# EasyEDA Pro project project-rp2350-board.epro, board PCB1
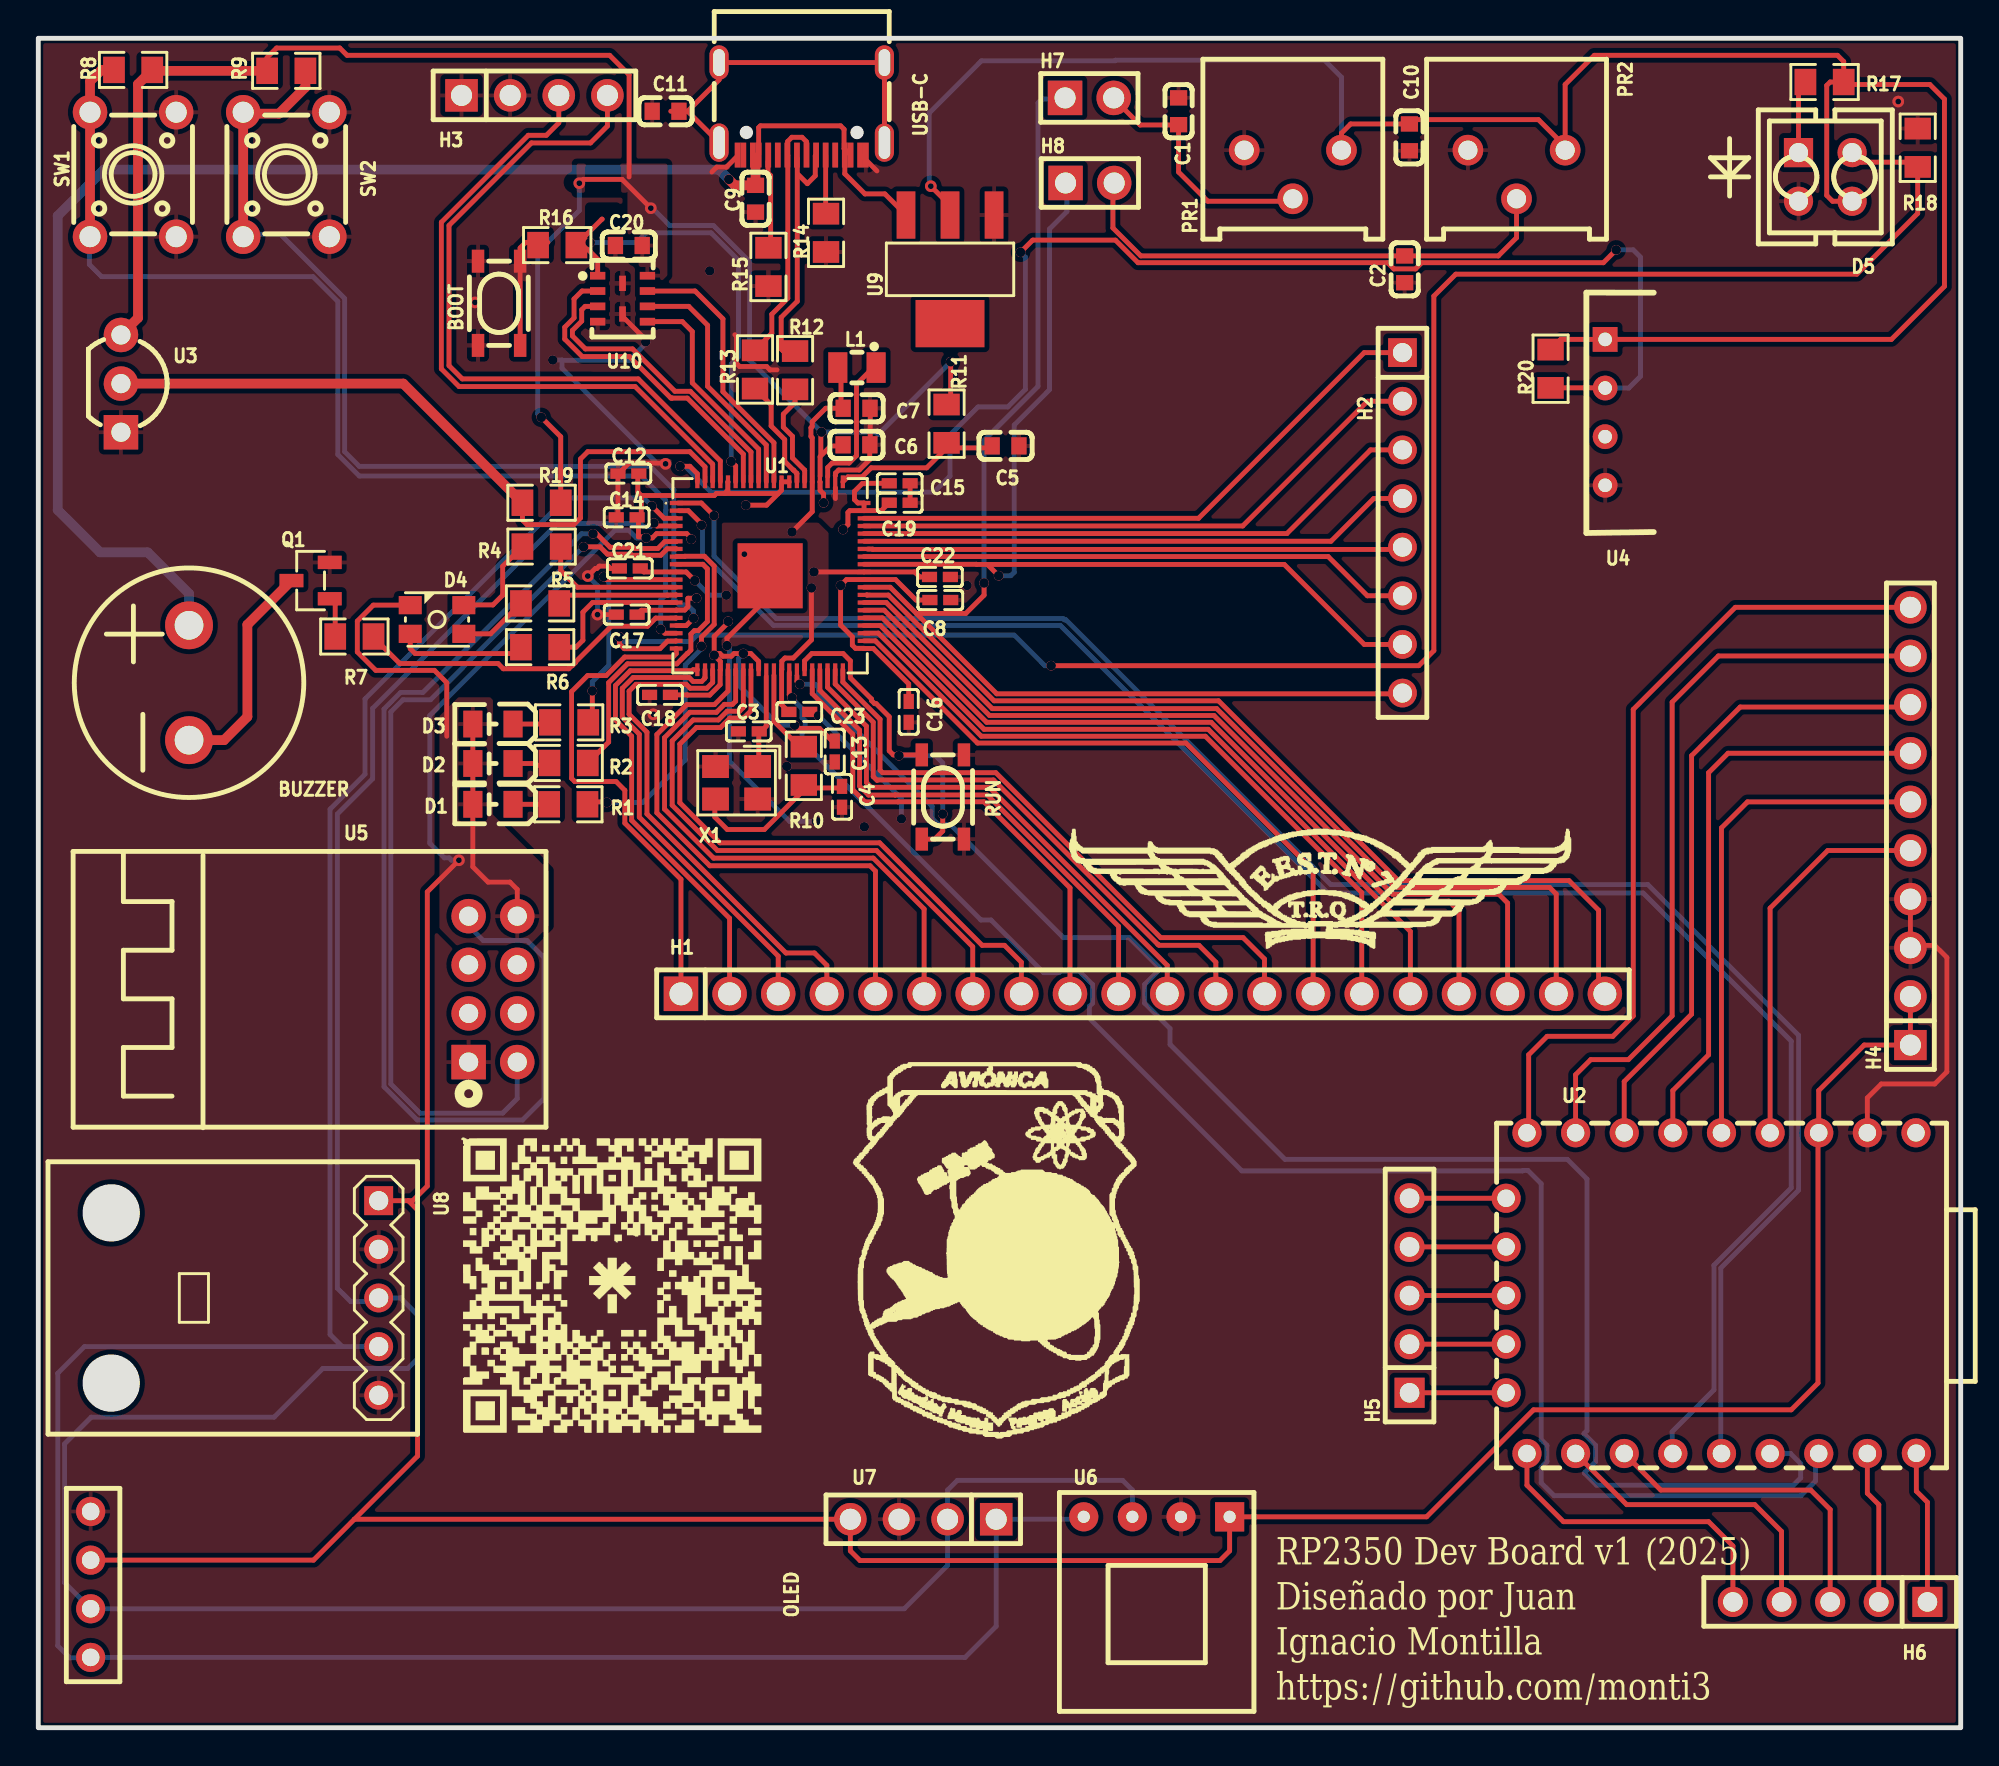
[diagram p1: board, top side]
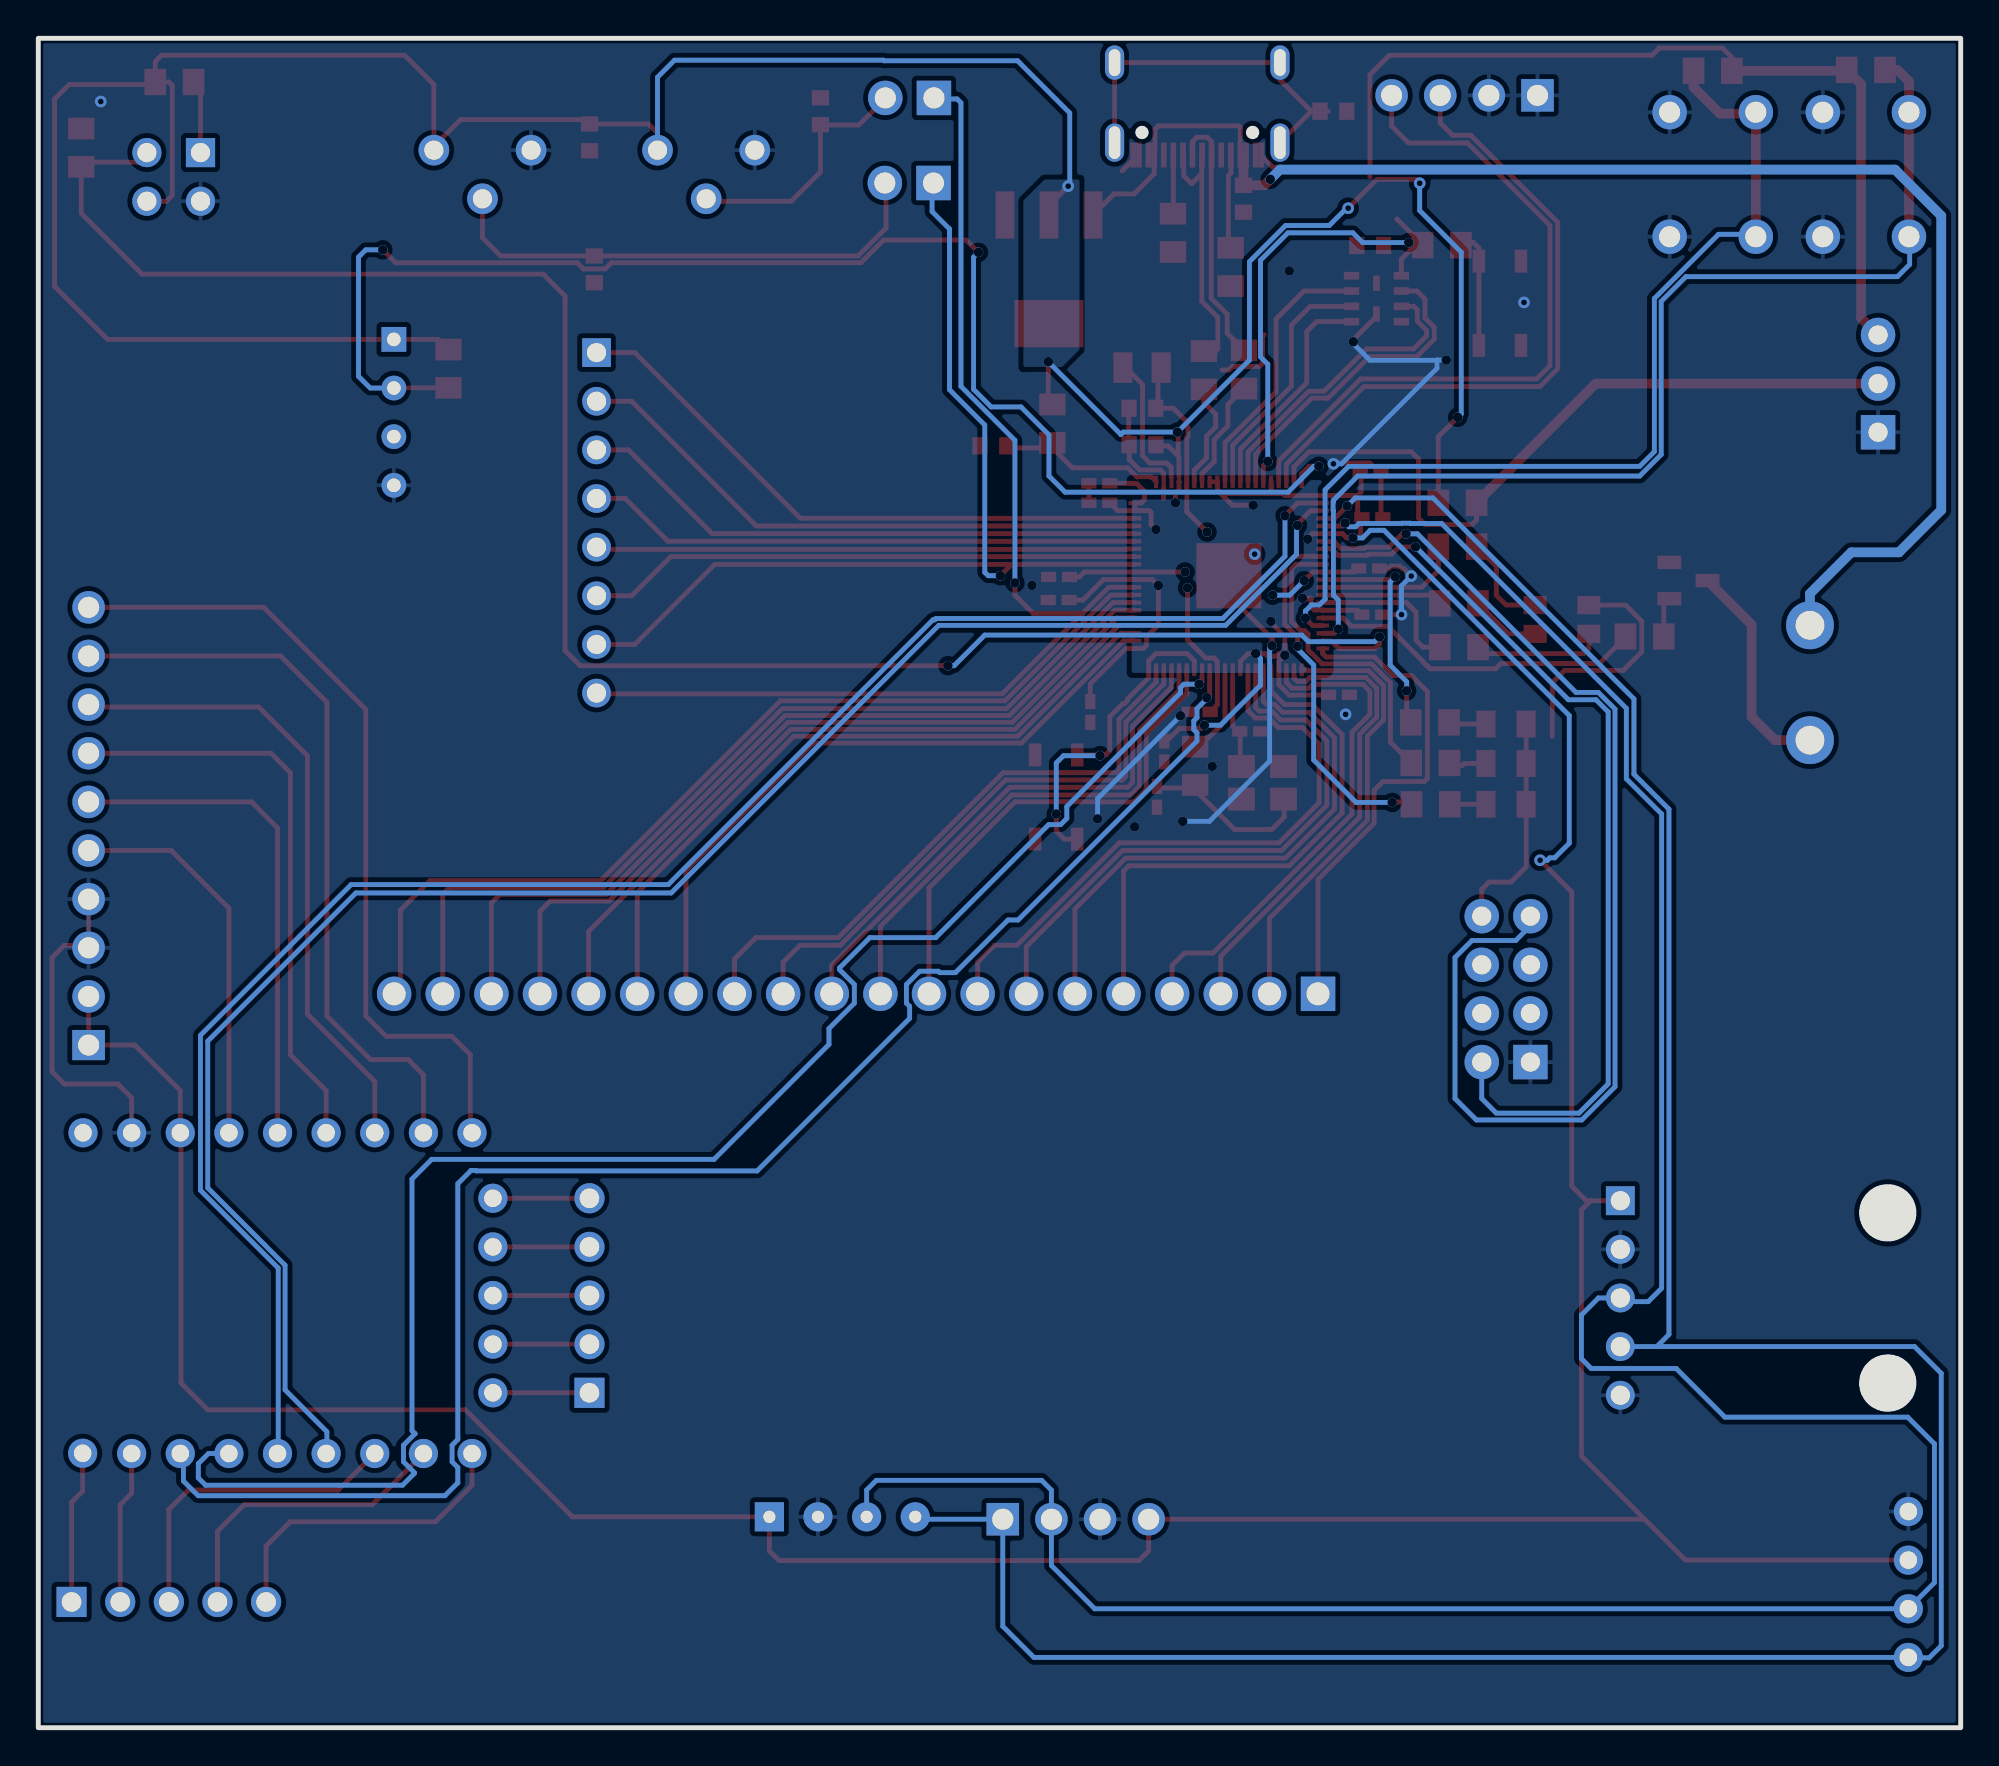
[diagram p2: board, bottom side, seen from below]

Outline 100.42 x 88.23 mm; copper layers: Top Layer, Bottom Layer. Coordinates in mm from the lower left corner of the outline.
Outline path: rectangle 0,88.23 100.42,0
Stack: Top Layer 0.035mm / Dielectric1 1.51mm FR4 er 4.5 / Bottom Layer 0.035mm

## Design rules (mm)
net $1N10864: DP1
net USB_D-: DP2
net $1N10892: DP1
net USB_D+: DP2
template: JLCPCB Capability(Two Layers Board)
spacing copperThickness1oz (default): track to track 0.102, other pairs 0.152 to 0.3
spacing copperThickness2oz: track to track 0.203, other pairs 0.152 to 0.3
track width copperThickness1oz (default): min 0.127, default 0.254, max 2.54
track width copperThickness2oz: min 0.203, default 0.254, max 2.54
differential pair differentialPair (default): width min 0.127, default 0.254, max 2.54; gap min 0.152, default 0.152
via viaSize (default): diameter min 0.5, default 0.61, max 10; hole min 0.3, default 0.305, max 6.3

## Placement (name value [footprint] x y rotation side)
BOOT  K2-1808SN-A4SW-01  [KEY-SMD_4P-L4.2-W3.2-P2.20-LS5.1-TL]  24.07 74.39 270 top
BUZZER  buzzer  [BUZ-TH_BD12.0-P6.00-D0.9-RD]  7.87 54.57 90 top
C1  100nF  [C0603]  59.56 84.42 90 top
C2  100nF  [C0603]  71.37 76.16 270 top
C3  15pF  [C0402]  37.11 52.03 0 top
C4  15pF  [C0402]  41.98 48.62 270 top
C5  4.7uF  [C0603]  50.53 66.94 0 top
C6  4.7uF  [C0603]  42.74 67 0 top
C7  4.7uF  [C0603]  42.74 68.91 180 top
C8  100nF  [C0402]  47.12 58.89 180 top
C9  100nF  [C0603]  37.47 79.85 90 top
C10  100nF  [C0603]  71.62 83.06 90 top
C11  1nF  [C0603]  32.77 84.42 180 top
C12  100nF  [C0402]  30.82 65.5 0 top
C13  100nF  [C0402]  41.6 50.98 90 top
C14  100nF  [C0402]  30.73 63.21 0 top
C15  100nF  [C0402]  45 64.99 180 top
C16  100nF  [C0402]  45.47 53.05 90 top
C17  100nF  [C0402]  30.73 58.13 0 top
C18  100nF  [C0402]  32.47 53.94 0 top
C19  100nF  [C0402]  45 63.97 180 top
C20  100nF  [C0603]  30.85 77.41 0 top
C21  100nF  [C0402]  30.9 60.54 0 top
C22  100nF  [C0402]  47.1 60.1 180 top
C23  4.7uF  [C0402]  39.75 53.05 180 top
D1  YLED0805W  [LED0805-R-RD_WHITE]  23.75 48.22 180 top
D2  YLED0805W  [LED0805-R-RD_WHITE]  23.75 50.36 180 top
D3  YLED0805W  [LED0805-R-RD_WHITE]  23.75 52.42 180 top
D4  CLV1H-FKB-CMPRTHKBB2367453  [LED-SMD_4P-L3.2-W2.8-LS3.5-TL-B]  20.83 57.88 0 top
D5  CNY70  [OPTO-TH_CNY70]  93.34 80.99 0 top
H1  -  [HDR-TH_20P-P2.54-V-M-1]  57.7 38.33 0 top
H2  -  [HDR-TH_8P-P2.54-V-M]  71.26 62.92 270 top
H3  -  [HDR-TH_4P-P2.54-V-F]  25.92 85.25 0 top
H4  PZ254V-11-10P  [HDR-TH_10P-P2.54-V-M-1]  97.79 47.08 90 top
H5  -  [HDR-TH_5P-P2.54-V-F]  71.63 22.57 90 top
H6  -  [HDR-TH_5P-P2.54-V-F]  93.6 6.57 180 top
H7  -  [HDR-TH_2P-P2.54-V-M-1]  54.9 85.12 0 top
H8  -  [HDR-TH_2P-P2.54-V-M-1]  54.93 80.67 0 top
L1  AOTA-B201610S3R3-101-T  [IND-SMD_L2.0-W1.6_AOTA-B201610S3R3-101-T]  42.76 71.03 0 top
OLED  SSD1306 I2C OLED  [OLED_0.91_128X32]  0.2 13.83 0 top
PR1  10K  [RES-ADJ-TH_3P-L9.5-W9.5-P2.54-BR-BS]  65.53 81.12 90 top
PR2  10K  [RES-ADJ-TH_3P-L9.5-W9.5-P2.54-BR-BS]  77.22 81.12 90 top
Q1  S8050  [SOT-23-3_L2.9-W1.3-P1.90-LS2.4-BR]  14.22 59.91 0 top
R1  33kΩ  [R0805]  27.69 48.22 180 top
R2  33kΩ  [R0805]  27.7 50.38 180 top
R3  33kΩ  [R0805]  27.73 52.5 180 top
R4  33kΩ  [R0805]  26.29 61.69 180 top
R5  33kΩ  [R0805]  26.21 58.72 180 top
R6  33kΩ  [R0805]  26.21 56.43 180 top
R7  33kΩ  [R0805]  16.51 56.99 180 top
R8  33kΩ  [R0805]  4.95 86.58 180 top
R9  33kΩ  [R0805]  12.95 86.53 0 top
R10  1K  [R0805]  39.99 50.23 270 top
R11  33  [R0805]  47.44 68.1 270 top
R12  22R  [R0805]  39.53 70.9 90 top
R13  22R  [R0805]  37.44 70.93 90 top
R14  5K1  [R0805]  41.15 78.07 90 top
R15  5K1  [R0805]  38.14 76.29 90 top
R16  1kΩ  [R0805]  27.11 77.43 0 top
R17  100R  [R0805]  93.31 85.95 180 top
R18  10K  [R0805]  98.17 82.51 90 top
R19  10K  [R0805]  26.29 63.97 0 top
R20  10K  [R0805]  78.99 70.97 90 top
RUN  K2-1808SN-A4SW-01  [KEY-SMD_4P-L4.2-W3.2-P2.20-LS5.1-TL]  47.25 48.61 90 top
SW1  B3F-1000  [KEY-TH_4P-L6.2-W6.2-P4.50-LS6.5]  4.95 81.12 90 top
SW2  B3F-1000  [KEY-TH_4P-L6.2-W6.2-P4.50-LS6.5]  12.95 81.12 90 top
U1  RP2350B  [QFN-80_L10.0-W10.0-P0.40-TL-EP3.4]  38.23 60.16 0 top
U2  RP2040-Zero  [COMM-SMD_RP2040-ZERO]  87.38 22.57 270 top
U3  DS18B20  [TO-92-3_L4.8-W3.7-P2.54-R]  4.32 70.2 270 top
U4  DHT11  [SENSOR-TH_DHT11_90DEG]  81.84 68.69 270 top
U5  2.4GHz  [WIFIM-TH_8P-L24.7-W14.4-P2.54]  23.75 38.57 180 top
U6  BMP180  [BMP-180]  58.42 5.93 0 top
U7  HTU21D  [HDR-TH_4P-P2.54-V-M]  46.23 10.89 180 top
U8  -  [GY-302 (BH1750)]  10.16 22.44 180 top
U9  -  [SOT-223-4_L6.5-W3.5-P2.30-LS7.0-BR]  47.62 76.16 90 top
U10  W25Q32JVUUIQ  [USON-8_L4.0-W3.0-P0.80-BL_WINBOND_UU]  30.52 74.63 270 top
USB-C  -  [USB-C-SMD_KH-TYPE-C-16P]  39.88 84.55 180 top
X1  ABM8-272-T3  [CRYSTAL-SMD_4P-L3.2-W2.5-BL]  36.47 49.35 180 top

## Footprints (pads in the part's own frame, mm; a bottom-side part is the same pattern mirrored in y, then rotated)
BMP-180
  rect 1.524x1.524 hole 0.635: 1(3.81,5.08)
  round 1.524 hole 0.635: 2(1.27,5.08) 3(-1.27,5.08) 4(-3.81,5.08)
BUZ-TH_BD12.0-P6.00-D0.9-RD
  round 2.5 hole 1.5: 1(-3,0) 2(3,0)
C0402
  rect 0.79x0.54 smd: 1(-0.545,0) 2(0.545,0)
C0603
  rect 0.8x0.9 smd: 1(-0.7,0) 2(0.7,0)
COMM-SMD_RP2040-ZERO
  round 1.524 hole 0.914: 1(8.238,10.725) 2(8.25,8.165) 3(8.25,5.625) 4(8.25,3.085) 5(8.25,0.545) 6(8.25,-1.995) 7(8.25,-4.535) 8(8.25,-7.075) 9(8.25,-9.615) 10(5.08,-10.705) 11(2.54,-10.705) 12(0,-10.705) 13(-2.54,-10.705) 14(-5.08,-10.705) 15(-8.5,-9.615) 16(-8.5,-7.075) 17(-8.5,-4.535) 18(-8.5,-1.995) 19(-8.5,0.545) 20(-8.5,3.085) 21(-8.5,5.625) 22(-8.5,8.165) 23(-8.5,10.705)
CRYSTAL-SMD_4P-L3.2-W2.5-BL
  rect 1.4x1.2 smd: 1(-1.1,-0.85) 2(1.1,-0.85) 3(1.1,0.85) 4(-1.1,0.85)
GY-302 (BH1750)
  rect 1.508x1.508 hole 1x1: 1(-7.62,-5.08)
  round 1.508 hole 1x1: 2(-7.62,-2.54) 3(-7.62,0) 4(-7.62,2.54) 5(-7.62,5.08)
HDR-TH_2P-P2.54-V-M-1
  rect 1.8x1.8 hole 1.1: 1(-1.27,0)
  round 1.8 hole 1.1: 2(1.27,0)
HDR-TH_4P-P2.54-V-F
  rect 1.7x1.7 hole 1.1: 1(-3.81,0)
  round 1.7 hole 1.1: 2(-1.27,0) 3(1.27,0) 4(3.81,0)
HDR-TH_4P-P2.54-V-M
  rect 1.7x1.7 hole 1.1: 1(-3.81,0)
  round 1.7 hole 1.1: 2(-1.27,0) 3(1.27,0) 4(3.81,0)
HDR-TH_5P-P2.54-V-F
  rect 1.575x1.575 hole 1.02: 1(-5.08,0)
  round 1.575 hole 1.02: 2(-2.54,0) 3(0,0) 4(2.54,0) 5(5.08,0)
HDR-TH_8P-P2.54-V-M
  rect 1.5x1.5 hole 1: 1(-8.89,0)
  round 1.5 hole 1: 2(-6.35,0) 3(-3.81,0) 4(-1.27,0) 5(1.27,0) 6(3.81,0) 7(6.35,0) 8(8.89,0)
HDR-TH_10P-P2.54-V-M-1
  rect 1.575x1.7 hole 1.1: 1(-11.43,0)
  round 1.7 hole 1.1: 2(-8.89,0) 3(-6.35,0) 4(-3.81,0) 5(-1.27,0) 6(1.27,0) 7(3.81,0) 8(6.35,0) 9(8.89,0) 10(11.43,0)
HDR-TH_20P-P2.54-V-M-1
  rect 1.8x1.8 hole 1.2: 1(-24.13,0)
  round 1.8 hole 1.2: 2(-21.59,0) 3(-19.05,0) 4(-16.51,0) 5(-13.97,0) 6(-11.43,0) 7(-8.89,0) 8(-6.35,0) 9(-3.81,0) 10(-1.27,0) 11(1.27,0) 12(3.81,0) 13(6.35,0) 14(8.89,0) 15(11.43,0) 16(13.97,0) 17(16.51,0) 18(19.05,0) 19(21.59,0) 20(24.13,0)
IND-SMD_L2.0-W1.6_AOTA-B201610S3R3-101-T
  rect 1x1.6 smd: 1(-1,0) 2(1,0)
KEY-SMD_4P-L4.2-W3.2-P2.20-LS5.1-TL
  rect 1.2x0.65 smd: 1(-2.2,1.1) 2(2.2,1.1) 3(-2.2,-1.1) 4(2.2,-1.1)
KEY-TH_4P-L6.2-W6.2-P4.50-LS6.5
  round 1.8 hole 1.1: 1(-3.251,2.251) 2(3.251,2.251) 3(-3.251,-2.251) 4(3.251,-2.251)
LED0805-R-RD_WHITE
  rect 1x1.399 smd: 1(1.05,0) 2(-1.05,0)
LED-SMD_4P-L3.2-W2.8-LS3.5-TL-B
  rect 1.2x0.95 smd: 1(-1.4,0.75) 2(-1.4,-0.75) 3(1.4,-0.75) 4(1.4,0.75)
OLED_0.91_128X32
  round 1.524 hole 0.914: 1(2.54,-2.54) 2(2.54,-5.08) 3(2.54,-7.62) 4(2.54,-10.16)
OPTO-TH_CNY70
  rect 1.524x1.524 hole 1: 1(-1.4,1.27)
  round 1.524 hole 1: 2(-1.4,-1.27) 3(1.4,-1.27) 4(1.4,1.27)
QFN-80_L10.0-W10.0-P0.40-TL-EP3.4
  rect 0.665x0.22 smd: 1(-4.907,3.8) 2(-4.907,3.4) 3(-4.907,3) 4(-4.907,2.6) 5(-4.907,2.2) 6(-4.907,1.8) 7(-4.907,1.4) 8(-4.907,1) 9(-4.907,0.6) 10(-4.907,0.2) 11(-4.907,-0.2) 12(-4.907,-0.6) 13(-4.907,-1) 14(-4.907,-1.4) 15(-4.907,-1.8) 16(-4.907,-2.2) 17(-4.907,-2.6) 18(-4.907,-3) 19(-4.907,-3.4) 20(-4.907,-3.8) 41(4.907,-3.8) 42(4.907,-3.4) 43(4.907,-3) 44(4.907,-2.6) 45(4.907,-2.2) 46(4.907,-1.8) 47(4.907,-1.4) 48(4.907,-1) 49(4.907,-0.6) 50(4.907,-0.2) 51(4.907,0.2) 52(4.907,0.6) 53(4.907,1) 54(4.907,1.4) 55(4.907,1.8) 56(4.907,2.2) 57(4.907,2.6) 58(4.907,3) 59(4.907,3.4) 60(4.907,3.8)
  rect 0.22x0.665 smd: 21(-3.8,-4.907) 22(-3.4,-4.907) 23(-3,-4.907) 24(-2.6,-4.907) 25(-2.2,-4.907) 26(-1.8,-4.907) 27(-1.4,-4.907) 28(-1,-4.907) 29(-0.6,-4.907) 30(-0.2,-4.907) 31(0.2,-4.907) 32(0.6,-4.907) 33(1,-4.907) 34(1.4,-4.907) 35(1.8,-4.907) 36(2.2,-4.907) 37(2.6,-4.907) 38(3,-4.907) 39(3.4,-4.907) 40(3.8,-4.907) 61(3.8,4.907) 62(3.4,4.907) 63(3,4.907) 64(2.6,4.907) 65(2.2,4.907) 66(1.8,4.907) 67(1.4,4.907) 68(1,4.907) 69(0.6,4.907) 70(0.2,4.907) 71(-0.2,4.907) 72(-0.6,4.907) 73(-1,4.907) 74(-1.4,4.907) 75(-1.8,4.907) 76(-2.2,4.907) 77(-2.6,4.907) 78(-3,4.907) 79(-3.4,4.907) 80(-3.8,4.907)
  rect 3.4x3.4 smd: 81(0,0)
R0805
  rect 1.133x1.377 smd: 1(-1,0) 2(1,0)
RES-ADJ-TH_3P-L9.5-W9.5-P2.54-BR-BS
  round 1.6 hole 1: 1(1.27,-2.54) 2(-1.27,0) 3(1.27,2.54)
SENSOR-TH_DHT11_90DEG
  rect 1.296x1.296 hole 0.711: 1(-3.81,0)
  round 1.296 hole 0.711: 2(-1.27,0) 3(1.27,0) 4(3.81,0)
SOT-23-3_L2.9-W1.3-P1.90-LS2.4-BR
  rect 1.25x0.7 smd: 1(1,-0.95) 2(1,0.95) 3(-1,0)
SOT-223-4_L6.5-W3.5-P2.30-LS7.0-BR
  rect 2.47x0.98 smd: 1(2.835,-2.3) 2(2.835,0) 3(2.835,2.3)
  rect 2.47x3.6 smd: 4(-2.835,0)
TO-92-3_L4.8-W3.7-P2.54-R
  rect 1.8x1.8 hole 1: 1(2.54,0)
  round 1.8 hole 1: 2(0,0) 3(-2.54,0)
USB-C-SMD_KH-TYPE-C-16P
  oval 1x2 hole 0.6x1.7: 1(-4.32,1.765) 2(4.32,1.765)
  oval 1x1.8 hole 0.6x1.4: 3(-4.32,-2.415) 4(4.32,-2.415)
  rect 0.3x1.3 smd: A1(-3.35,2.415) A4(-2.55,2.415) A5(-1.25,2.415) A6(-0.25,2.415) A7(0.25,2.415) A8(1.25,2.415) A9(2.55,2.415) A12(3.35,2.415) B1(3.05,2.415) B4(2.25,2.415) B5(1.75,2.415) B6(0.75,2.415) B7(-0.75,2.415) B8(-1.75,2.415) B9(-2.25,2.415) B12(-3.05,2.415)
USON-8_L4.0-W3.0-P0.80-BL_WINBOND_UU
  rect 0.4x0.8 smd: 1(-1.2,-1.3) 2(-0.4,-1.3) 3(0.4,-1.3) 4(1.2,-1.3) 5(1.2,1.3) 6(0.4,1.3) 7(-0.4,1.3) 8(-1.2,1.3)
  rect 0.8x0.35 smd: 9(-0.802,0) 10(0.798,0)
WIFIM-TH_8P-L24.7-W14.4-P2.54
  rect 1.8x1.8 hole 1: 1(1.27,3.81)
  round 1.8 hole 1: 2(1.27,1.27) 3(1.27,-1.27) 4(1.27,-3.81) 5(-1.27,3.81) 6(-1.27,1.27) 7(-1.27,-1.27) 8(-1.27,-3.81)

## Nets
As in the schematic, except:
1V1: C7.2 C21.2 C22.2 C23.2 L1.1 U1.10 U1.32 U1.51 U1.65
3V3: C6.1 C8.2 C10.2 C12.2 C13.2 C14.2 C15.2 C16.2 C17.2 C18.2 C19.2 C20.2 D1.1 D2.1 D3.1 D4.1 D5.3 H4.1 H4.2 OLED.2 PR1.1 PR2.1 R8.1 R9.1 R11.1 R17.1 R19.2 R20.2 U1.5 U1.15 U1.24 U1.29 U1.41 U1.50 U1.59 U1.60 U1.64 U1.68 U1.69 U1.76 U2.21 U3.3 U4.1 U5.8 U6.1 U7.4 U8.1 U9.2 U10.8
5V: BUZZER.2 C9.2 U9.3 USB-C.A4 USB-C.A9 USB-C.B4 USB-C.B9
RP2040_ADC0: H4.8 U2.17
RP2040_ADC1: H4.7 U2.18
RP2040_ADC2: H4.6 U2.19
RP2040_ADC3: H4.5 U2.20
RP2040_GP14: H4.10 U2.15
RP2040_GP15: H4.9 U2.16
RP2350_GP18: R8.2 SW1.1 SW1.2 U1.18
$1N24500: BUZZER.1 Q1.3

Pads without a net: U2 23; U4 3; U5 2 3 6 7; U9 4; USB-C A8 B8

## Via types
v1: diameter 0.5, hole 0.5, Top Layer to Bottom Layer, 55 vias
v2: diameter 0.61, hole 0.305, Top Layer to Bottom Layer, 11 vias

## Routing (per net, layer and track width the routed paths; a pad name or vN(x,y) marks a point on that pad's centre or on a via; arc(x,y) is an arc through that point)
1V1: length 28.6
  Top Layer w0.254: 39.21,53.05 38.83,53.43 U1.32 38.84,55.26 38.84,55.7 39,55.86 39.44,55.86 40.39,56.81 v1(40.39,59.53) ; v1(40.51,60.36) U1.51 45.78,60.36 46.04,60.1 46.4,60.1 ; v1(39.37,62.45) 40.43,63.51 U1.65 40.43,67.37 40.36,67.43 40.36,67.89 40.43,67.96 40.43,68.2 41.13,68.91 C7.2 ; v1(34.29,59.91) 33.84,60.36 U1.10 31.63,60.36 C21.2 ; 41.93,69.02 41.93,70.88
  Bottom Layer w0.254: v1(34.29,59.91) 35.05,59.15 v1(35.94,59.15)
3V3: length 477.8
  Top Layer w0.254: 36.07,57.75 35.31,56.99 v1(35.31,56.01) ; v2(46.62,80.51) 47.57,79.56 47.57,79.51 ; 19.33,27.52 U8.1 ; 19.33,27.52 19.56,27.52 20.32,28.29 20.32,43.65 v2(21.97,45.3) ; 19.33,27.52 19.81,27.04 19.81,14.19 16.51,10.89 ; U1.76 36.02,65.06 36.02,64.62 35.85,64.46 ; v1(26.28,68.43) 27.29,67.42 R19.2 ; v2(28.26,80.66) 28.46,80.86 30.49,80.86 v2(32,79.36) ; v1(35.31,56.01) 35.63,55.69 U1.24 35.62,55.24 35.62,54.47 35.07,53.93 33.91,53.93 33.9,53.94 33.02,53.94 ; v1(35.31,56.01) 35.39,56.1 35.6,56.1 35.74,55.96 36.2,55.96 36.34,56.1 v1(36.83,56.1) 37.22,56.1 37.63,55.69 U1.29 ; 71.81,83.86 71.93,83.98 78.36,83.98 79.76,82.59 ; U5.8 25.02,43.78 24.64,44.16 23.5,44.16 22.7,44.96 D1.1 D2.1 D3.1 ; R20.2 79.53,72.5 U4.1 96.8,72.5 99.57,75.28 99.57,85.05 98.81,85.82 94.44,85.82 R17.1 94.31,87.01 93.98,87.34 81.28,87.34 79.76,85.82 79.76,82.59 ; 31.5,64.35 35.31,64.35 35.42,64.46 35.85,64.46 ; 31.5,64.35 31.5,63.35 31.35,63.2 31.35,62.19 31.69,62.19 v1(31.75,62.14) 32.07,62.14 32.3,62.36 U1.5 33.87,62.36 34.16,62.07 ; 31.5,64.35 31.32,64.53 31.32,65.44 C12.2 ; 38.65,64.46 38.82,64.62 38.82,65.06 U1.69 U1.68 ; 38.65,64.46 35.85,64.46 ; 38.65,64.46 38.04,63.85 v1(36.96,63.85) ; 16.51,10.89 14.38,8.75 2.74,8.75 ; 16.51,10.89 U7.4 42.42,9.24 42.93,8.73 61.72,8.73 62.23,9.24 U6.1 72.52,11.01 78.1,16.6 91.57,16.6 92.96,18 92.96,31.03 U2.21 93,33.28 95.38,35.65 97.79,35.65 H4.2 ; 40.84,65.38 40.84,66.38 41.4,66.94 42.09,66.94 ; v1(41.02,63.97) 41.02,64.44 40.84,64.62 40.84,65.06 U1.64 ; C13.2 41.47,51.53 40.81,52.19 39.67,52.19 v1(39.51,52.36) ; 94.06,85.95 93.6,85.95 93.42,85.77 93.42,80.03 93.73,79.72 D5.3 ; 79.76,82.59 79.76,82.39 ; U1.59 42.39,63.56 42.29,63.46 42.29,62.83 v1(42.04,62.58) ; U1.59 44.04,63.56 44.45,63.97 ; U1.59 U1.60 42.81,63.96 42.63,64.14 42.63,64.57 43.03,64.97 43.18,64.97 43.2,64.99 44.45,64.99 ; 30.86,80.99 30.86,86.32 29.84,87.34 16.13,87.34 15.75,87.72 12.45,87.72 11.94,87.21 ; 68.07,82.39 68.07,83.28 68.55,83.76 C10.2 ; C16.2 45.47,54.51 43.62,56.36 U1.41 43.12,56.37 42.69,56.37 42.52,56.53 42.52,56.97 41.91,57.58 v1(41.91,59.65) 42.22,59.96 U1.50 44.78,59.96 45.85,58.89 46.29,58.89 46.42,58.77 ; 47.66,69.24 v1(47.66,71.34) ; C17.2 31.51,58.36 U1.15 33.33,58.37 33.77,58.37 33.93,58.53 33.93,58.97 33.95,58.99 v1(34.38,58.99) ; v1(40.91,67.66) 40.88,67.63 40.88,66.48 ; 21.34,51.78 21.34,54.57 20.69,55.22 17.63,55.22 16.66,56.18 16.66,57.79 17.5,58.63 D4.1
  Top Layer w0.508: U3.3 5.21,73.62 5.21,85.83 R8.1 6,86.53 R9.1
  Bottom Layer w0.254: v1(36.83,56.1) 36.58,55.84 36.58,54.45 38.67,52.36 v1(39.51,52.36) ; v1(26.28,68.43) 26.27,68.43 26.09,68.61 26.09,77.06 28.26,79.23 v2(28.26,80.66) ; v2(21.97,45.3) 21.59,45.3 21.46,45.43 21.21,45.43 20.45,46.19 20.45,52.86 30.12,62.53 30.85,62.53 31.24,62.14 v1(31.75,62.14) ; 32.17,79.26 32.98,78.45 35.26,78.45 37.15,76.56 37.15,71.42 v1(40.91,67.66) 43.74,67.66 43.87,67.54 47.63,71.3 ; 68.07,82.39 68.07,86.2 67.18,87.09 56.27,87.09 56.24,87.06 49.26,87.06 46.54,84.33 46.54,80.48
  vias: v1(34.11,62.07) v1(36.04,57.78)
5V: length 77.5
  Top Layer w0.254: U9.3 44.22,80.1 43.18,80.1 42.13,81.15 42.13,82.13 ; 37.63,82.13 37.63,83.57 37.72,83.66 41.91,83.66 42.09,83.48 42.09,82.47 42.43,82.13
  Top Layer w0.508: v1(36.07,80.86) 36.38,80.55 C9.2 37.47,81.99
  Bottom Layer w0.508: BUZZER.2 7.87,59.23 5.72,61.38 3.22,61.38 1.02,63.59 1.02,78.96 3.43,81.37 35.56,81.37 v1(36.07,80.86)
GND: length 78.9
  Top Layer w0.254: 43.81,81.3 43.08,82.03 43.08,82.04 ; U1.81 38.23,59.15 35.97,56.89 v1(35.97,56.51) ; 31.77,72.45 30.54,73.68 30.54,73.73 ; U2.22 95.54,32.89 96.27,33.62 99.06,33.62 99.69,34.25 99.69,40.22 99.06,40.86 97.92,40.86 H4.3 97.79,43.27 ; C21.1 29.88,60.54 29.76,60.67 29.3,60.67 29.18,60.54 29.1,60.54 v2(28.7,60.15) ; 43.43,66.91 43.43,66.23 42.89,65.68 41.8,65.68 41.64,65.52 41.64,65.4 41.63,65.4 ; 36.53,82.13 36.53,82.09 35.94,81.5 35.43,81.5 35.18,81.24 ; 36.38,72.75 36.47,72.66 36.47,71.25 36.63,71.09 38.04,71.09 38.22,70.91 38.59,70.91 ; 43.46,68.96 43.46,67.24 43.34,67.12 ; C17.1 v2(29.21,58.13) ; C14.1 30.28,63.3 C12.1 30.31,65.5 30.86,66.05 32.55,66.05 32.64,66.13 ; C19.1 C15.1 ; 41.64,64.19 41.64,64.74 41.63,64.75
  Bottom Layer w0.254: v2(28.7,60.15) 29.21,59.64 v2(29.21,58.13) ; 31.76,72.31 30.86,71.41 27.36,71.41 ; 27.36,71.41 27.34,71.43 v1(26.87,71.43) ; 27.36,71.41 27.36,70.99 32.35,66 v2(32.77,66) ; 26.87,71.41 26.83,71.41 ; v1(40.64,47.34) 39.24,47.34 36.1,50.48 36.1,56.38 v1(35.97,56.51) ; v1(45.09,47.46) 45.09,48.52 v1(40.76,52.85)
  vias: v1(31.73,72.38) v1(35.07,76.08) v1(39.1,50.21) v1(43.15,47.05) v1(48.51,59.65) v2(22.81,74.44) v2(32.13,52.92) v2(36.88,61.29) v2(97.16,84.93)
I2C_SCL_0: length 94.6
  Top Layer w0.254: v1(34.65,62.8) 34.65,62.87 33.95,63.56 33.47,63.56
  Bottom Layer w0.254: U2.6 85.34,14.36 85.34,15.46 87.53,17.64 87.53,24.15 91.57,28.19 91.57,35.85 83.83,43.59 67.36,43.59 53.38,57.57 38.4,57.57 34.7,61.27 34.7,62.75 v1(34.65,62.8)
I2C_SCL_1: length 148.9
  Top Layer w0.254: v1(32.16,62.91) 32.31,62.76 U1.4
  Bottom Layer w0.254: v1(32.16,62.91) 31.96,62.72 31.6,62.72 ; 31.6,62.72 31.44,62.89 29.22,62.89 29.21,62.9 28.75,62.9 28.73,62.89 27.12,62.89 17.47,53.24 17.47,49.56 15.62,47.72 15.62,22.95 16.32,22.25 17.59,22.25 U8.3 18.92,22.44 19.81,21.55 19.81,19.27 19.3,18.76 14.86,18.76 12.32,16.22 2.77,16.22 1.37,14.82 1.37,7.58 OLED.3 45.24,6.21 47.5,8.47 47.5,12.41 48.01,12.92 56.64,12.92 57.15,12.41 U6.3
I2C_SDA_0: length 94.8
  Top Layer w0.254: 33.42,63.96 34.64,63.96 v1(35.3,63.3)
  Bottom Layer w0.254: v1(35.3,63.3) 35.3,61.18 38.55,57.93 53.53,57.93 53.6,57.86 53.69,57.86 67.51,44.03 84.07,44.03 91.95,36.16 91.95,28.07 87.88,24.01 87.88,14.36 U2.5
I2C_SDA_1: length 147.6
  Top Layer w0.254: v1(32.05,63.8) 32.69,63.16 U1.3
  Bottom Layer w0.254: U6.4 54.48,10.89 U7.1 50.04,5.3 48.41,3.67 OLED.4 2.71,3.65 1.65,3.65 1.02,4.28 1.02,18.51 2.41,19.9 15.88,19.9 ; 15.88,19.9 U8.4 ; 15.88,19.9 15.24,20.54 15.24,47.97 17.07,49.8 17.07,53.73 27.57,64.23 31.62,64.23 v1(32.05,63.8)
QSPI_SCLK: length 13
  Top Layer w0.254: 38.03,65.07 38.03,66.99 34.96,70.05 34.96,73.24 33.98,74.23 U10.6
QSPI_SD0: length 11.8
  Top Layer w0.254: U10.5 33.64,73.43 34.16,72.91 34.16,70.24 37.63,66.77 37.63,65.07
QSPI_SD1: length 17
  Top Layer w0.254: U1.74 36.83,66.52 33.91,69.44 33.11,69.44 33.11,69.44 33.04,69.44 30.88,71.61 28.41,71.61 27.5,72.52 27.5,73.14 27.99,73.63 27.99,74.62 28.4,75.03 U10.2
QSPI_SD2: length 15.9
  Top Layer w0.254: U10.3 28.56,74.23 28.39,74.05 28.39,73.46 27.9,72.97 27.9,72.69 28.58,72.01 31.04,72.01 33.26,69.79 34.06,69.79 37.23,66.62 U1.73
QSPI_SD3: length 14.2
  Top Layer w0.254: U10.7 34.31,75.03 35.76,73.57 35.76,69.77 38.43,67.11 38.43,65.07
QSPI_SS: length 24.9
  Top Layer w0.254: R16.2 28.24,77.56 28.35,77.56 ; v1(36.19,66.13) 36.43,65.9 U1.75 ; v1(28.83,77.56) 28.35,77.56 ; 28.35,77.56 29.22,76.69 U10.1 ; 29.46,78.78 29.44,78.78 28.29,77.63
  Bottom Layer w0.254: v1(36.19,66.13) 36.19,71.21 36.58,71.59 36.58,76.64 35.14,78.07 31.75,78.07 31.24,77.56 v1(28.83,77.56)
RP2040_ADC0: length 33.7
  Top Layer w0.254: U2.17 82.84,33.75 86.36,37.27 86.36,50.76 88.9,53.3 97.66,53.3 97.79,53.43
RP2040_ADC1: length 30.5
  Top Layer w0.254: U2.18 85.38,33.28 87.25,35.14 87.25,49.88 88.26,50.89 H4.7
RP2040_ADC2: length 26.4
  Top Layer w0.254: U2.19 87.92,46.99 89.28,48.35 97.79,48.35
RP2040_ADC3: length 20.3
  Top Layer w0.254: U2.20 90.46,42.8 93.47,45.81 H4.5
RP2040_GP0: length 8
  Top Layer w0.254: H6.1 98.68,11.78 98.1,12.35 U2.1
RP2040_GP1: length 8
  Top Layer w0.254: U2.2 95.54,12.25 96.14,11.65 H6.2
RP2040_GP6: length 16.8
  Top Layer w0.254: H6.3 93.6,11.39 92.58,12.41 84.75,12.41 U2.7
RP2040_GP7: length 16.1
  Top Layer w0.254: H6.4 91.06,10.25 89.66,11.65 82.97,11.65 U2.8
RP2040_GP8: length 16.7
  Top Layer w0.254: H6.5 88.52,9.49 87.25,10.76 79.67,10.76 77.76,12.66 U2.9
RP2040_GP9: length 5
  Top Layer w0.254: U2.10 H5.1
RP2040_GP10: length 5
  Top Layer w0.254: H5.2 U2.11
RP2040_GP11: length 5
  Top Layer w0.254: U2.12 H5.3
RP2040_GP12: length 5
  Top Layer w0.254: H5.4 U2.13
RP2040_GP13: length 5
  Top Layer w0.254: H5.5 U2.14
RP2040_GP14: length 43.1
  Top Layer w0.254: H4.10 88.65,58.51 83.31,53.18 83.31,37.17 82.25,36.11 78.81,36.11 77.85,35.14 77.85,31.16 U2.15
RP2040_GP15: length 39.2
  Top Layer w0.254: U2.16 80.3,34.1 81.09,34.89 83.06,34.89 85.34,37.18 85.34,53.56 87.76,55.97 H4.9
RP2350_ADC0: length 62.2
  Top Layer w0.254: 45.87,58.19 48.45,58.19 49.4,59.15 v1(49.4,59.78) ; 45.87,58.19 44.5,59.56 U1.49 ; 45.87,58.19 50.06,54 70.8,54 70.84,54.04
  Bottom Layer w0.254: v1(49.4,59.78) 49.4,67.23 52.22,70.05 52.22,84.86 52.42,85.06 53.49,85.06
RP2350_ADC1: length 53
  Top Layer w0.254: U1.52 49.01,60.76 49.02,60.75 49.58,60.75 ; 49.58,60.75 65.08,60.75 69.26,56.57 H2.7 ; 49.58,60.75 v1(50.16,60.16)
  Bottom Layer w0.254: 53.55,80.53 53.73,80.35 53.73,79.18 52.82,78.27 52.82,69.88 50.98,68.04 50.98,60.34 50.8,60.16 v1(50.16,60.16)
RP2350_ADC2: length 29
  Top Layer w0.254: H2.6 69.43,59.11 67.38,61.16 43.13,61.16
RP2350_ADC3: length 27.5
  Top Layer w0.254: 43.32,61.55 43.58,61.55 43.6,61.54 70.81,61.54
RP2350_ADC4: length 29
  Top Layer w0.254: 43.13,61.96 67.53,61.96 69.76,64.19 H2.4
RP2350_ADC5: length 29.9
  Top Layer w0.254: H2.3 69.59,66.73 65.22,62.36 43.13,62.36
RP2350_ADC6: length 30.8
  Top Layer w0.254: 43.13,62.76 62.91,62.76 69.43,69.27 H2.2
RP2350_ADC7: length 31.7
  Top Layer w0.254: H2.1 69.26,71.81 60.61,63.16 43.13,63.16
RP2350_GP2: length 38.6
  Top Layer w0.254: U1.79 34.83,65.85 34.04,66.64 28.7,66.64 28.32,66.26 28.32,63.18 27.97,62.83 25.53,62.83 25.29,63.07 R19.1
  Top Layer w0.508: U3.2 19.07,70.2 R19.1
RP2350_GP3: length 75.8
  Top Layer w0.254: v1(82.42,77.18) 81.75,76.51 72.26,76.51 71.94,76.19 70.81,76.19 70.49,76.51 57.45,76.51 56.27,77.69 51.94,77.69 v1(51.31,77.05) ; U1.80 34.43,65.49 34.04,65.88 v1(33.53,65.88) ; U4.2 81.84,69.97 R20.1
  Bottom Layer w0.254: v1(82.42,77.18) 83.31,77.18 83.69,76.8 83.69,70.58 83.08,69.96 U4.2 ; v1(33.53,65.88) 33.78,65.88 35.13,64.52 46.78,64.52 47.62,65.37 47.62,67.52 49.09,68.98 50.64,68.98 51.56,69.9 51.56,76.8 v1(51.31,77.05)
RP2350_GP10: length 19.1
  Top Layer w0.254: R1.1 28.81,48.35 29.67,48.35 v1(29.7,48.32) ; v1(34.64,56.48) 34.64,56.96 35.31,57.62 35.31,60.67 34.8,61.18 33.78,61.18 33.77,61.17 33.33,61.17 U1.8
  Bottom Layer w0.254: v1(34.64,56.48) 34.64,56.34 33.8,55.5 33.8,50.54 31.58,48.32 v1(29.7,48.32)
RP2350_GP11: length 16.1
  Top Layer w0.254: R2.1 29.79,51.47 29.79,54.58 30.78,55.56 33.36,55.56 33.9,56.1 33.91,56.1 34.09,56.28 34.09,57.11 34.27,57.29 34.47,57.29 34.95,57.77 34.95,60.52 34.71,60.76 U1.9
RP2350_GP12: length 11.7
  Top Layer w0.254: v1(29.53,60.11) 29.69,59.96 33.02,59.96 ; v1(28.94,54.15) 28.94,52.72 R3.1
  Bottom Layer w0.254: v1(28.94,54.15) 28.94,54.63 29.8,55.49 29.8,59.84 v1(29.53,60.11)
RP2350_GP13: length 7.6
  Top Layer w0.254: 33.32,59.56 28.16,59.56 27.29,60.43 R4.1
RP2350_GP14: length 6.3
  Top Layer w0.254: 33.32,59.16 33.31,59.15 32.87,59.15 32.87,59.15 27.64,59.15 R5.1
RP2350_GP15: length 7.9
  Top Layer w0.254: 33.32,58.76 28.95,58.76 28.45,58.26 28.45,56.79 28.09,56.43 R6.1
RP2350_GP16: length 17.6
  Top Layer w0.254: U1.16 33.31,57.95 32.25,57.95 31.83,57.52 29.93,57.52 28.06,55.65 28.06,55.63 27.89,55.46 27.87,55.46 27.71,55.3 24.29,55.3 24.02,55.58 18.88,55.58 17.51,56.95 R7.1
RP2350_GP17: length 52.4
  Top Layer w0.254: U1.17 33.85,57.56 v1(34.23,57.94)
  Top Layer w0.508: SW2.1 SW2.2 10.78,84.29 12.57,84.29 13.95,85.67 R9.2
  Bottom Layer w0.254: v1(34.23,57.94) 34.23,58.32 33.91,58.64 33.49,58.64 33.2,58.93 33.2,64.65 31.97,65.87 16.77,65.87 16,66.64 16,74.64 12.65,77.99 10.83,77.99 SW2.1
RP2350_GP18: length 58.7
  Top Layer w0.254: U1.18 32.72,57.16 v1(32.51,57.37)
  Top Layer w0.508: R8.2 3.3,86.58 2.7,85.98 SW1.2 SW1.1
  Bottom Layer w0.254: SW1.1 2.67,77.83 2.67,76.42 3.3,75.78 14.35,75.78 15.65,74.49 15.65,66.49 16.77,65.37 31.5,65.37 32.77,64.1 32.77,64.05 32.78,64.03 32.78,63.57 32.77,63.56 32.77,59.15 32.51,58.89 v1(32.51,57.37)
RP2350_GP19: length 99.3
  Top Layer w0.254: U1.19 33.31,56.75 32.87,56.75 32.47,56.35 30.61,56.35 30.35,56.61 30.35,56.97 v1(30.36,56.97) ; D5.4 95.24,81.76 98.17,81.76 98.17,79.09 95,75.91 74.04,75.91 72.9,74.77 72.9,56.25 72.11,55.46 v1(52.91,55.46)
  Bottom Layer w0.254: v1(30.36,56.97) 30.61,56.72 34.07,56.72 34.42,57.06 50.98,57.06 52.58,55.46 v1(52.91,55.46)
RP2350_GP20: length 26
  Top Layer w0.254: H1.1 33.57,44.31 30.64,47.24 30.64,48.96 30.18,49.42 28.02,49.42 27.86,49.58 27.86,54.11 28.69,54.95 29.66,54.95 30.63,55.92 33.15,55.92 33.33,56.1 33.33,56.35 U1.20
RP2350_GP21: length 23.2
  Top Layer w0.254: U1.21 34.21,55.25 34.16,55.2 30.92,55.2 30.15,54.43 30.15,52.63 30.99,51.78 30.99,47.39 36.11,42.27 H1.2
RP2350_GP22: length 24.5
  Top Layer w0.254: 34.83,55.26 34.83,54.85 34.82,54.84 34.82,54.8 34.65,54.64 34.2,54.64 34,54.85 31.07,54.85 30.5,54.28 30.5,52.78 31.39,51.89 31.39,47.55 38.65,40.3 H1.3
RP2350_GP23: length 26.3
  Top Layer w0.254: 35.23,55.26 35.23,54.59 34.92,54.29 34.05,54.29 33.85,54.49 31.22,54.49 30.86,54.13 30.86,52.92 31.79,51.99 31.79,47.72 39.05,40.46 40.54,40.46 41.19,39.81 H1.4
RP2350_GP24: length 28.9
  Top Layer w0.254: 36.03,55.26 36.03,54.14 35.32,53.43 33.87,53.43 32.31,51.87 32.31,47.78 35.08,45.01 43.45,45.01 43.73,44.73 H1.5
RP2350_GP25: length 30
  Top Layer w0.254: H1.6 46.27,42.76 43.62,45.41 35.28,45.41 32.71,47.98 32.71,51.7 34.04,53.03 35.42,53.03 35.84,53.45 36.26,53.45 36.43,53.61 36.43,55.26
RP2350_GP26: length 31
  Top Layer w0.254: 36.83,55.26 36.83,53.28 36.63,53.09 35.98,53.09 35.53,52.63 34.2,52.63 33.11,51.54 33.11,48.17 35.47,45.81 43.78,45.81 48.81,40.79 H1.7
RP2350_GP27: length 32.6
  Top Layer w0.254: H1.8 51.35,39.98 50.47,40.86 49.3,40.86 43.95,46.21 35.6,46.21 33.51,48.31 33.51,51.37 34.37,52.23 35.63,52.23 36.13,52.73 36.84,52.73 37.23,53.11 37.23,55.26
RP2350_GP28: length 26.2
  Top Layer w0.254: H1.9 53.89,43.86 49.4,48.36 44.91,48.36 44.91,48.35 43.18,48.35 42.54,48.99 42.54,51.89 40.43,54.01 40.43,55.26
RP2350_GP29: length 27
  Top Layer w0.254: 40.83,55.26 40.83,54.17 42.9,52.1 42.9,49.17 43.37,48.71 44.76,48.71 44.77,48.71 49.57,48.71 56.43,41.85 H1.10
RP2350_GP30: length 27.9
  Top Layer w0.254: 41.23,55.26 41.23,54.34 43.26,52.31 43.26,49.37 43.51,49.11 49.67,49.11 58.97,39.81 H1.11
RP2350_GP31: length 30
  Top Layer w0.254: 43.81,49.47 43.61,49.67 43.61,52.52 41.63,54.5 41.63,55.26 ; 43.81,49.49 49.89,49.49 58.48,40.9 58.5,40.9 58.54,40.86 60.63,40.86 61.51,39.98 H1.12
RP2350_GP32: length 32
  Top Layer w0.254: H1.13 64.05,40.14 62.93,41.26 58.63,41.26 50.02,49.88 44.1,49.88 43.97,50 43.97,52.66 42.03,54.61 42.03,55.26
RP2350_GP33: length 34.9
  Top Layer w0.254: 43.13,56.76 43.72,56.76 49.06,51.43 59.94,51.42 66.59,44.78 H1.14
RP2350_GP34: length 36.9
  Top Layer w0.254: H1.15 69.13,43.61 60.96,51.78 49.26,51.78 43.88,57.16 43.13,57.16
RP2350_GP35: length 38.4
  Top Layer w0.254: 43.13,57.56 43.98,57.56 49.4,52.14 61.12,52.14 71.67,41.59 H1.16
RP2350_GP36: length 41.7
  Top Layer w0.254: H1.17 74.21,42.64 73.68,43.17 70.6,43.17 61.26,52.51 49.54,52.51 44.08,57.96 43.13,57.96
RP2350_GP37: length 44.7
  Top Layer w0.254: H1.18 76.75,43.07 76.29,43.53 70.75,43.53 61.41,52.86 49.69,52.86 44.19,58.36 43.13,58.36
RP2350_GP38: length 47.7
  Top Layer w0.254: H1.19 79.29,43.54 78.95,43.88 70.89,43.88 61.56,53.22 49.83,53.22 44.29,58.76 43.13,58.76
RP2350_GP39: length 49.7
  Top Layer w0.254: H1.20 81.83,37.83 ; 43.27,59.16 43.28,59.15 44.4,59.15 49.93,53.63 61.65,53.63 71.04,44.24 79.96,44.24 81.5,42.69 81.5,38.55
RP2350_RX: length 34.5
  Top Layer w0.254: 35.23,65.07 35.23,65.99 31.17,70.04 21.98,70.04 21.05,70.97 21.05,78.62 25.6,83.17 26.54,83.17 27.19,83.81 27.19,85.25
RP2350_RX_1: length 47.7
  Top Layer w0.254: 33.32,61.56 33.31,61.57 32.86,61.57 32.51,61.23 31,61.23 30.94,61.29 29.73,61.29 29.34,61.67 v1(28.48,61.67)
  Bottom Layer w0.254: v1(28.48,61.67) 20.49,53.69 19.05,53.69 18.42,53.05 18.42,33.62 19.94,32.1 24.26,32.1 25.02,32.86 U5.5
RP2350_TX: length 36.7
  Top Layer w0.254: H3.4 29.73,83.65 28.85,82.76 25.76,82.76 21.45,78.46 21.45,71.13 22.15,70.44 31.34,70.44 35.63,66.15 35.63,65.07
RP2350_TX_1: length 61.3
  Top Layer w0.254: 33.32,61.96 33.32,61.95 33.32,61.95 32.73,61.95 32.37,61.59 31.15,61.59 31.09,61.65 29.87,61.65 29.17,62.35 v1(28.98,62.35)
  Bottom Layer w0.254: U5.4 22.48,41.87 23.24,41.11 25.53,41.11 26.42,40.22 26.42,32.86 25.3,31.74 19.79,31.74 18.06,33.47 18.06,53.2 18.93,54.07 20.09,54.07 28.38,62.35 v1(28.98,62.35)
RP2350_VREG_AVDD: length 8.6
  Top Layer w0.254: 49.94,66.97 49.81,66.84 47.56,66.84 ; U1.61 42.28,65.33 43.03,65.33 43.5,65.8 46.4,65.8 47.46,66.86
RP2350_VREG_LX: length 7.2
  Top Layer w0.254: 43.6,71.02 42.74,70.15 42.74,66.43 42.35,66.05 41.47,66.05 41.23,65.81 41.23,65.34
RP2350_XIN: length 4.6
  Top Layer w0.254: 38.03,54.89 38.03,52.31 37.77,52.05 ; 37.54,50.57 37.63,50.67 37.63,52.14
RP2350_XOUT: length 4.2
  Top Layer w0.254: 38.43,54.95 38.43,52.56 39.73,51.26
RUN: length 17.8
  Top Layer w0.254: U1.35 40.03,55.72 40.41,56.1 42.04,56.1 42.42,55.72 42.42,54.83 43.52,53.73 43.52,53.65 43.68,53.48 43.76,53.48 44.45,52.8 44.45,51.02 44.66,50.81 RUN.2 ; v1(47.24,47.72) 47.24,46.83 46.82,46.41 RUN.1
  Bottom Layer w0.254: v1(47.24,47.72) 47.24,50.38 46.86,50.76 v1(44.96,50.76)
SWCLK: length 85.9
  Top Layer w0.254: 39.49,53.78 39.5,53.77 ; 39.23,55.12 39.23,53.95 v1(39.38,53.79)
  Bottom Layer w0.254: v1(39.38,53.79) 39.38,53.73 39.89,53.22 39.89,52.75 40.06,52.58 40.06,52.13 39.89,51.96 39.89,51.53 49.24,42.18 49.76,42.18 52.51,39.43 53.33,39.43 53.4,39.51 54.38,39.51 55.07,38.82 55.07,37.84 54.9,37.67 54.9,37.04 62.87,29.08 77.53,29.08 77.56,29.1 77.81,29.1 78.5,28.41 78.5,15.05 78.8,14.75 78.8,13.89 78.5,13.59 78.5,12.79 79.18,12.12 92.07,12.12 92.84,12.88 92.84,14.16 U2.3
SWDIO: length 85.7
  Top Layer w0.254: v1(39.78,54.5) 39.63,54.64 39.63,54.93
  Bottom Layer w0.254: v1(39.78,54.5) 40.58,54.5 40.75,54.33 40.75,54.05 46.69,48.11 46.69,47.49 47.02,47.16 47.64,47.16 53.54,41.26 56.99,41.26 58.56,39.69 58.56,39.58 57.79,38.82 57.79,37.84 59.12,36.51 59.12,35.68 65.12,29.68 79.87,29.68 80.9,28.65 80.9,15.52 80.74,15.36 80.74,15.35 81.34,14.75 81.34,13.89 80.78,13.32 80.78,13.28 81.39,12.66 91.68,12.66 92.06,13.05 92.06,13.79 91.53,14.32 U2.4
USB_D+: length 13.5
  Top Layer w0.254: 40.13,82.13 40.13,82.83 39.89,83.06 39.36,83.06 39.14,82.84 39.14,82.15 39.13,82.13 39.15,82.11 39.15,74.65 38.32,73.82 38.32,72.83 37.44,71.95 R13.2
USB_D-: length 13.4
  Top Layer w0.254: 39.63,81.96 39.65,81.95 39.65,74.49 38.81,73.66 38.81,72 38.91,71.9 R12.2 ; 39.7,81.11 40.17,80.64 40.59,81.05 40.59,82.09 40.63,82.13
$1N3968: length 1.9
  Top Layer w0.254: D1.2 26.69,48.22
$1N3972: length 2
  Top Layer w0.254: R2.2 26.58,50.26 26.03,50.26 25.94,50.36 D2.2
$1N3977: length 2
  Top Layer w0.254: R3.2 26.64,52.42 D3.2
$1N4236: length 2.1
  Top Layer w0.254: Q1.1 15.51,58.67 R7.2
$1N7540: length 13
  Top Layer w0.254: PR1.2 65.41,79.72 61.09,79.72 59.56,81.24 C1.1 ; 56.04,85.22 57.55,83.7 59.31,83.7
$1N7663: length 26.5
  Top Layer w0.254: H8.2 56.13,80.61 56.13,78.32 57.59,76.86 C2.1 76.26,76.86 77.22,77.82 PR2.2
$1N8203: length 8.2
  Top Layer w0.254: 40.11,49.1 37.93,46.91 35.99,46.91 35.34,47.56 35.34,48.43 ; 40.49,49.12 40.53,49.08 41.91,49.08
$1N10864: length 5.5
  Top Layer w0.254: 40.03,65.07 40.03,65.66 40.02,65.67 40.02,65.68 39.4,66.31 39.4,67.44 38.92,67.92 38.92,68.6 39.53,69.21 R12.1
$1N10892: length 5.8
  Top Layer w0.254: R13.1 38.28,69.09 38.28,67.98 38.99,67.27 38.99,66.13 39.44,65.68 39.45,65.68 39.62,65.52 39.62,65.5 39.63,65.49 U1.67
$1N15103: length 3.3
  Top Layer w0.254: 41.15,78.82 41.13,78.84 41.13,82.13
$1N15154: length 4.4
  Top Layer w0.254: 38.12,81.82 38.12,81.2 38.25,81.06 38.25,77.72 38.44,77.54
$1N16516: length 19.2
  Top Layer w0.254: 33.04,84.42 C11.1 33.92,84.42 ; 33.92,84.42 USB-C.2 ; 33.92,84.42 35.56,86.06 USB-C.4 USB-C.3 USB-C.1
$1N20125: length 6.7
  Top Layer w0.254: BOOT.2 BOOT.1 25.17,77.28 25.46,77.57 26.62,77.57
$1N24500: length 11.6
  Top Layer w0.508: Q1.3 10.92,57.61 10.92,52.8 9.7,51.57 BUZZER.1
$1N39889: length 5.2
  Top Layer w0.254: D4.4 22.24,58.64 23.75,58.64 24.26,59.15 24.26,60.65 R4.2
$1N39893: length 3.6
  Top Layer w0.254: D4.3 23.62,57.13 R5.2
$1N39897: length 6.8
  Top Layer w0.254: R6.2 24.88,56.1 19.69,56.1 19.43,56.36 D4.2
$1N45855: length 3.9
  Top Layer w0.254: 92.55,85.95 91.94,85.34 D5.1

## Copper pours and planes (outline as drawn; the poured copper is in the pictures)
1V1 on Top Layer: 41.28,58.08 40.52,57.33 35.7,57.33 35.7,62.93 40.75,62.93 41.28,62.41
3V3 on Top Layer: 21.94,53.81 23.61,53.81 23.75,53.68 23.75,47.69 26.67,44.77 26.67,41.87 25.65,40.86 21.84,40.86 20.95,41.75 20.95,52.83
3V3 on Top Layer: 28.12,81.69 28.12,80.17 28.11,80.16 30.73,80.16 30.78,80.21 30.78,76.91 31.12,76.57 31.35,76.57 31.35,75.49 31.32,75.45 32.47,75.45 32.86,75.84 32.86,81.66 32.84,81.69
3V3 on Bottom Layer: 46.02,80.86 46.02,71.98 46.94,71.07 48.94,71.07 48.96,71.05 48.96,79.75 47.85,80.86
3V3 on Bottom Layer: 33.02,64.96 33.23,65.16 43.3,65.16 43.3,55.08 33.14,55.08 33.02,55.2
GND on Top Layer: 38.5,47.67 34.45,47.67 34.45,52.06 35.01,52.63 37.11,52.63 38.5,51.24
GND on Top Layer: 44.04,78.2 35.9,78.2 35.08,77.39 35.08,73.88 42.92,66.04 50.57,66.04 50.61,66 50.61,78.22 50.59,78.24 44.08,78.24
GND on Top Layer: 29.6,77.76 30.69,77.76 30.75,77.7 30.75,73.51 31.26,73.01 29.81,73.01 29.72,72.92 29.6,73.05
GND on Top Layer: 0,87.98 100.42,87.98 100.42,-0.25 0,-0.25
GND on Top Layer: 37.93,46.57 39.91,48.55 39.91,48.62 43.09,48.62 44.32,47.39 44.32,46.56 37.95,46.56
GND on Top Layer: 33.76,69.92 33.76,72.76 30.39,76.13 29.83,76.13 28.16,74.46 28.16,71.58 29.53,70.2 33.48,70.2
GND on Top Layer: 28.71,73.77 28.71,73 28.72,73 31.16,73 31.17,73 31.17,76.21 31.02,76.36 30.13,76.36 29.88,76.12 29.88,73.89 28.84,73.89
GND on Top Layer: 22.09,77.37 22.09,71.38 22.4,71.07 23.9,71.07 24.25,71.42 24.25,77.34 24.15,77.43 22.14,77.43
GND on Top Layer: 38.42,74.38 38.35,74.31 36.06,74.31 35.73,74.64 35.73,76.2 35.76,76.23 35.76,79.95 35.69,80.01 37.92,80.01 38.42,79.52
GND on Top Layer: 50.6,75.86 50.6,65.76 51.36,65 59.97,65 70.31,75.34 69.8,75.86
GND on Top Layer: 22.41,73.57 22.41,75.46 22.36,75.51 22.62,75.77 28.17,75.77 28.55,75.4 28.55,70.95 22.36,70.95 22.29,71.01 22.29,73.45
GND on Bottom Layer: 0,87.98 100.42,87.98 100.42,-0.25 0,-0.25
GND on Bottom Layer: 33.59,70.32 31.53,72.38 31.53,74.81 33.66,76.94 35.81,76.94 36.02,76.73 36.02,72.75
GND on Bottom Layer: 17.25,74 17.43,73.83 17.43,72.17 21.61,72.17 23.88,74.44 22.19,76.13 19.38,76.13

## Text on the board
Top Silkscreen Layer: RP2350 Dev Board v1 (2025) / Diseñado por Juan / Ignacio Montilla / https://github.com/monti3
